# Altium schematic sheet PIR_Part_V.1.SchDoc
size A4; Author: ON semicoductor; CompanyName: ON Semiconductor Germany; DrawnBy: Magdalena Vaclavek; Revision: V.1; SheetNumber: 2; SheetTotal: 2; ProjectName: Axsem-PIR
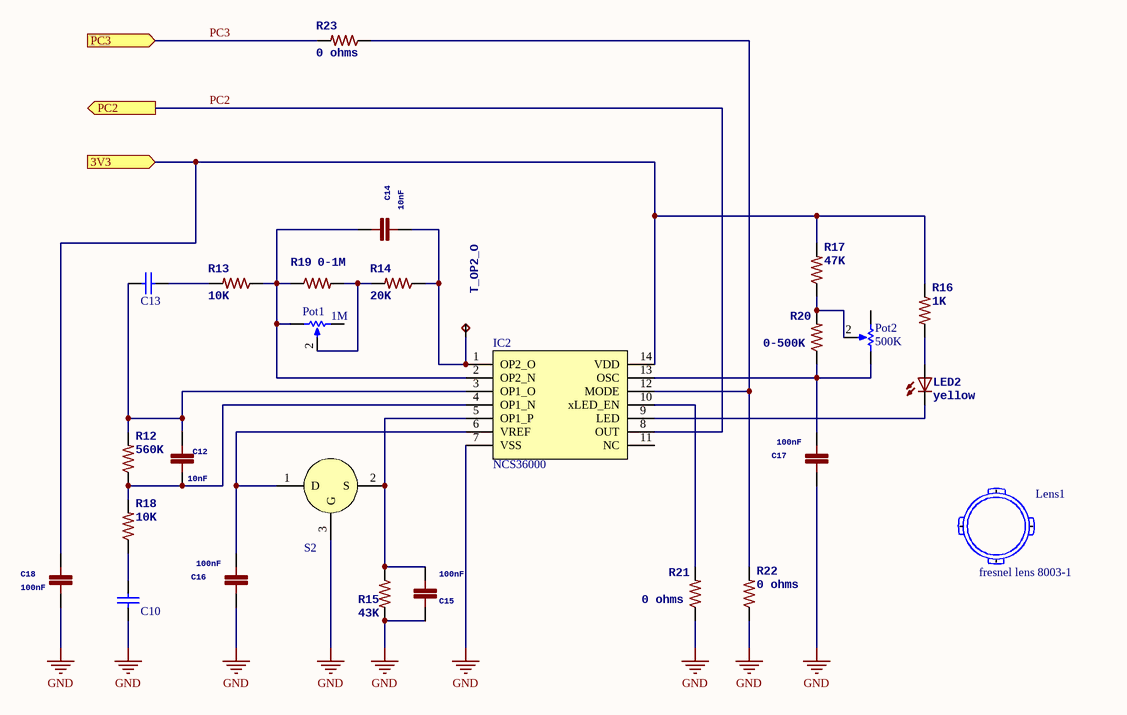
[diagram p0: PIR_Part_V.1.SchDoc]

## Parts
C10  33uF  [C1206]  (value not drawn)
C12  10nF  [C0402]
C13  33uF  [C1206]  (value not drawn)
C14  10nF  [C0402]
C15  100nF  [C0402]
C16  100nF  [C0402]
C17  100nF  [C0402]
C18  100nF  [C0603]
IC2  NCS36000  [SOIC127P600X175-14AN]
LED2  yellow  [LED0603 - Y]
Lens1  fresnel lens 8003-1  [Lens]
Pot1  1M  [Poti-4mm SMD]
Pot2  500K  [Poti-4mm SMD]
R12  560K  [R0402]
R13  10K  [R0402]
R14  20K  [R0402]
R15  43K  [R0402]
R16  1K  [R0402]
R17  47K  [R0402]
R18  10K  [R0402]
R19  0-1M  [R0402]
R20  0-500K  [R0402]
R21  0 ohms  [R0402]
R22  0 ohms  [R0402]
R23  0 ohms  [R0402]
S2  D203S  [ONSC-TO-5-3]  (value not drawn)
T_OP2_O  TP03  [PIN-03]  (value not drawn)

## Ports
3V3 (in), PC2 (out), PC3 (in)

## Nets
GND: C10.1 C15.1 C16.1 C17.1 C18.1 IC2.7(VSS) R15.2 R21.1 R22.1 S2.3(G)
3V3: C18.2 IC2.14(VDD) R16.1 R17.2 ; port 3V3
PC2: IC2.8(OUT) ; port PC2
PC3: R23.2 ; port PC3
NetC10_2: C10.2 R18.1
NetC12_1: C12.1 C13.2 IC2.3(OP1_O) R12.2
NetC12_2: C12.2 IC2.4(OP1_N) R12.1 R18.2
NetC13_1: C13.1 R13.2
NetC14_1: C14.1 IC2.2(OP2_N) Pot1.1 R13.1 R19.1
NetC14_2: C14.2 IC2.1(OP2_O) R14.1 T_OP2_O.P$1(TP)
NetC15_2: C15.2 IC2.5(OP1_P) R15.1 S2.2(S)
NetC16_2: C16.2 IC2.6(VREF) S2.1(D)
NetC17_2: C17.2 IC2.13(OSC) Pot2.3 R20.1
NetIC2_9: IC2.9(LED) LED2.C
NetIC2_10: IC2.10(xLED_EN) R21.2
NetIC2_12: IC2.12(MODE) R22.2 R23.1
NetLED2_A: LED2.A R16.2
NetPot1_2: Pot1.2 R14.2 R19.2
NetPot2_2: Pot2.2 R17.1 R20.2

Not connected (* = marked no-connect by the designer): IC2 11(NC); Lens1 Tab1 Tab2 Tab3 Tab4; Pot1 3; Pot2 1

## Library data of the parts
C10 C13 = C1206: Value: 33uF
C12 C14-C17 = C0402
  C12 C14: Value: 10nF
  C15-C17: Value: 100nF
C18 = C0603: Value: 100nF
IC2 = NCS36000: PIR sensor; Manufacturer: ON semiconductor; Part Description: PIR controller; Part Number: NCS36000; Component Link: http://www.onsemi.com/PowerSolutions/product.do?id=NCS36000
LED2 = LED0603 yellow: LED0603-Y; Color red: red; Color green: green; Color yellow: yellow
Lens1 = PIR Fresnel Lens 8003-1: type: Fresnel Lens R11.4; Model: 8003-1; Reference: PIR Fresnel lens 8003-1
Pot1 Pot2 = Trimpot SMD: Bourns 3364W SMD 4mm square Trimpot; Manufaturer: Bourns; Model: 3364W; Type: Trimming Potentiometer SMD
  Pot1: Value: 1M
  Pot2: Value: 500K
R12-R23 = R0402
  R12: Value: 560K
  R13 R18: Value: 10K
  R14: Value: 20K
  R15: Value: 43K
  R16: Value: 1K
  R17: Value: 47K
  R19: Value: 0-1M
  R20: Value: 0-500K
  R21-R23: Value: 0 ohms
S2 = D203S PIR sensor: PIR sensor; Manufacturer: PIR sensor CO.,LTD; Manufacturer Part Number: D203S; Pin Count: 3; Part: D203S
T_OP2_O = TP03: Test pad